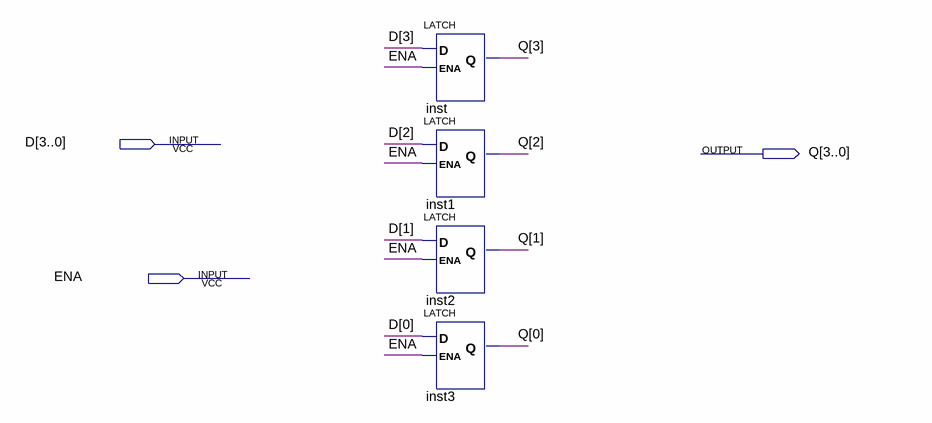
[diagram p0: schematic sheet]
// Quartus schematic dlatch4bit.bdf as structural Verilog: 4 symbols, 3 pins
module dlatch4bit (
  input  [3:0] D,
  input  ENA,
  output [3:0] Q
);

  LATCH inst (.D(D[3]), .ENA(ENA), .Q(Q[3]));
  LATCH inst1 (.D(D[2]), .ENA(ENA), .Q(Q[2]));
  LATCH inst2 (.D(D[1]), .ENA(ENA), .Q(Q[1]));
  LATCH inst3 (.D(D[0]), .ENA(ENA), .Q(Q[0]));
endmodule
